# Altium schematic sheet ReceiverPCB.SchDoc
size A4
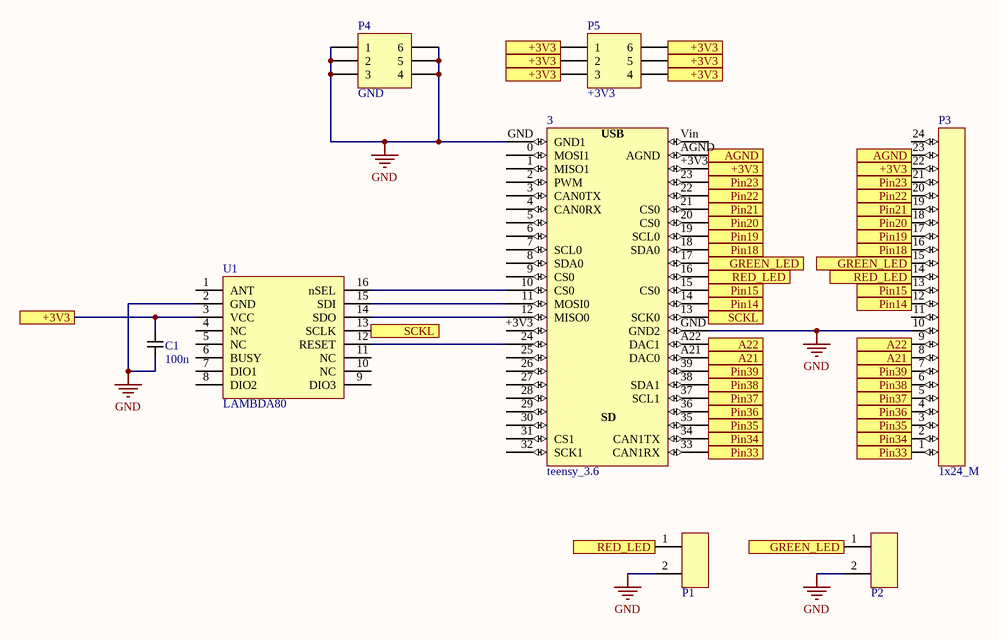
[diagram p0: ReceiverPCB.SchDoc]

## Parts
3  teensy_3.6  [teensy_3.6]
C1  value 100n  [C_SMD_0805_pcb]  (hidden comment: SMD)
P1  Red_LED  [JST_SE_2PIN]  (value not drawn)
P2  Green_LED  [JST_SE_2PIN]  (value not drawn)
P3  1x24_M  [PIN_HEADER_M_1x24]
P4  GND  [PIN_HEADER_M_2x3]
P5  +3V3  [PIN_HEADER_M_2x3]
U1  LAMBDA80  [LAMBDA62_SMT]

## Ports
+3V3, A21, A22, AGND, GREEN_LED, Pin14, Pin15, Pin18, Pin19, Pin20, Pin21, Pin22, Pin23, Pin33, Pin34, Pin35, Pin36, Pin37, Pin38, Pin39, RED_LED, SCKL

## Nets
GND: 3.GND(GND1) C1.2 P1.2 P2.2 P3.10 P4.1 P4.2 P4.3 P4.4 P4.5 P4.6 U1.2(GND)
+3V3: 3.+3V3 C1.1 P3.22 P5.1 P5.2 P5.3 P5.4 P5.5 P5.6 U1.3(VCC) ; port +3V3
A21: 3.A21(DAC0) P3.8 ; port A21
A22: 3.A22(DAC1) P3.9 ; port A22
AGND: 3.AGND P3.23 ; port AGND
GREEN_LED: 3.17 P2.1 P3.15 ; port GREEN_LED
Pin14: 3.14 P3.12 ; port Pin14
Pin15: 3.15(CS0) P3.13 ; port Pin15
Pin18: 3.18(SDA0) P3.16 ; port Pin18
Pin19: 3.19(SCL0) P3.17 ; port Pin19
Pin20: 3.20(CS0) P3.18 ; port Pin20
Pin21: 3.21(CS0) P3.19 ; port Pin21
Pin22: 3.22 P3.20 ; port Pin22
Pin23: 3.23 P3.21 ; port Pin23
Pin33: 3.33(CAN1RX) P3.1 ; port Pin33
Pin34: 3.34(CAN1TX) P3.2 ; port Pin34
Pin35: 3.35 P3.3 ; port Pin35
Pin36: 3.36 P3.4 ; port Pin36
Pin37: 3.37(SCL1) P3.5 ; port Pin37
Pin38: 3.38(SDA1) P3.6 ; port Pin38
Pin39: 3.39 P3.7 ; port Pin39
RED_LED: 3.16 P1.1 P3.14 ; port RED_LED
SCKL: 3.13(SCK0) U1.13(SCLK) ; port SCKL
Net3_10: 3.10(CS0) U1.16(nSEL)
Net3_11: 3.11(MOSI0) U1.15(SDI)
Net3_12: 3.12(MISO0) U1.14(SDO)
Net3_24: 3.24 U1.12(RESET)

Not connected (* = marked no-connect by the designer): 3 0(MOSI1) 1(MISO1) 2(PWM) 3(CAN0TX) 4(CAN0RX) 5 6 7(SCL0) 8(SDA0) 9(CS0) 25 26 27 28 29 30 31(CS1) 32(SCK1) Vin; P3 11 24; U1 1(ANT) 4(NC) 5(NC) 6(BUSY) 7(DIO1) 8(DIO2) 9(DIO3) 10(NC) 11(NC)

## Notes on the sheet
- (in symbol teensy_3.6) USB; SD

## Library data of the parts
C1 = C_SMD_0805: Supplier 1: *; Supplier Part Number 1: *
P1 P2 = JST_SE_2PIN: Supplier 1: *; Supplier Part Number 1: *
P3 = PIN_HEADER_M_1x24: Supplier Part Number 1: *; Supplier 1: *
P4 P5 = PIN_HEADER_M_2x3: Supplier 1: *; Supplier Part Number 1: *
U1 = LAMBDA_80_DIP